# Altium schematic sheet 01_Power.SchDoc: Power
size A4; SheetNumber: 1; SheetTotal: 3; PageSetup: Record=PageOptions|CenterHorizontal=True|CenterVertical=True|PrintScale=1.09|XCorrection=1.00|YCorrection=1.00|PrintKind=0|BorderSize=5000000|LeftOffset=0|BottomOffset=0|Orientation=2|PaperLength=1000|PaperWidth=1000|Scale=100|PaperSource=7|PrintQuality=-3|MediaType=1|DitherType=10|PrintScaleMode=1|PaperKind=A4|PaperIndex=9; SK_ProjectName: ESP8266 IoT Dimmer; Version: R01
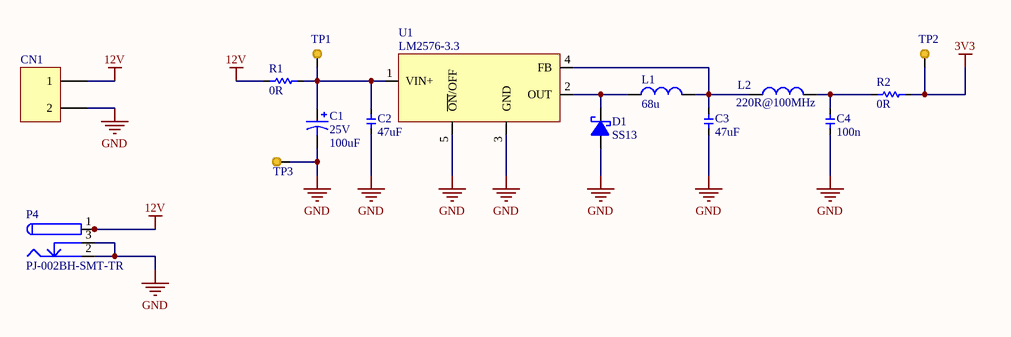
[diagram p0: 01_Power.SchDoc]

## Parts
C1  25V  value 100uF  [Electrolytic Cap 2.54mm]
C2  value 47uF  [CAPC_1411_3528_X08N]  (hidden comment: Cap)
C3  value 47uF  [CAPC_1411_3528_X08N]  (hidden comment: Cap)
C4  value 100n  [0603 - CAP]  (hidden comment: Cap)
CN1  Terminal 2 - 5mm  [Terminal 2]  (value not drawn)
D1  SS13  [SOD123F]
L1  value 68u  [IND_TH_SMD]  (hidden comment: Inductor)
L2  value 220R@100MHz  [0603]  (hidden comment: Inductor)
P4  PJ-002BH-SMT-TR  [PJ-002BH-SMT-TR]
R1  value 0R  [0603]  (hidden comment: Res)
R2  value 0R  [0603]  (hidden comment: Res)
TP1  Test Point 0.6mm  [TP_SMD_1mm]  (value not drawn)  (no BOM)
TP2  Test Point 0.6mm  [TP_SMD_1mm]  (value not drawn)  (no BOM)
TP3  Test Point 0.6mm  [TP_SMD_1mm]  (value not drawn)  (no BOM)
U1  LM2576-3.3  [TO263-5]

## Nets
3V3: R2.1 TP2.1
12V: CN1.1 P4.1 P4.1A R1.2
GND: C1.2 C2.1 C3.1 C4.1 CN1.2 D1.A P4.2 P4.3 TP3.1 U1.3(GND) U1.5(~{ON}/OFF)
NetC1_1: C1.1 C2.2 R1.1 TP1.1 U1.1(VIN+)
NetC3_2: C3.2 L1.2 L2.1 U1.4(FB)
NetC4_2: C4.2 L2.2 R2.2
NetD1_K: D1.K L1.1 U1.2(OUT)

## Notes on the sheet
- Title:
- Project:
- Version:
- sasakaranovic.com
- Sasa Karanovic
- Project available at
- Date:
- Time:
- Sheet
- of

## Library data of the parts
C1 = Cap Electrolytic: CAP ALUM 100UF 20% 25V RADIAL; Manufacturer: Nichicon; Manufacturer Part Number: UHE1E101MED; Distributor: DigiKey; Distributor Part Number: 493-1548-ND
C2 C3 = Cap: CAP TANT POLY47UF 20% 16V 1210; Manufacturer: AVX Corporation; Manufacturer Part Number: TCNT476M016R0200A; Distributor Part Number: 478-9595-1-ND; Distributor: DigiKey
C4 = Cap: Capacitor; Manufacturer: AVX Corporation; Manufacturer Part Number: 06035C104KAT2A; Distributor Part Number: 478-5052-1-ND; Distributor: DigiKey
CN1 = Terminal 2: TERM BLOCK PCB 2POS 5.0MM GREEN; Manufacturer: Phoenix Contact; Manufacturer Part Number: 1935161; Distributor: DigiKey; Distributor Part Number: 277-1667-ND
D1 = Diode Schotky: DIODE SCHOTTKY 30V 1A SMA; Manufacturer: ON Semiconductor; Manufacturer Part Number: SS13; Distributor: DigiKey; Distributor Part Number: SS13FSCT-ND
L1 = Inductor: FIXED IND 68UH 1A 289 MOHM SMD; Manufacturer: Laird-Signal Integrity Products; Manufacturer Part Number: TYS6045680M-10; Distributor: DigiKey; Distributor Part Number: 240-2747-1-ND
L2 = Inductor: FERRITE BEAD 220 OHM 0603 1LN; Manufacturer: Murata Electronics North America; Manufacturer Part Number: BLM18KG221SN1D; Distributor: DigiKey; Distributor Part Number: 490-5255-1-ND
P4 = DC Jack 2.5mm - Male: CONN PWR JACK 2.5X5.5MM SOLDER; Manufacturer: CUI Inc.; Manufacturer Part Number: PJ-002BH-SMT-TR; Distributor: DigiKey; Distributor Part Number: CP-002BHPJCT-ND
R1 R2 = Res: Resistor; Manufacturer: Yageo; Manufacturer Part Number: RC0603JR-070RL; Distributor: DigiKey; Distributor Part Number: 311-0.0GRCT-ND
TP1-TP3 = TP
U1 = LM2576-xx: Switching mode regulator [ 3v3, 5v, 12v and ADJ ]; Manufacturer: Microchip Technology; Manufacturer Part Number: LM2576-3.3WU; Distributor: DigiKey; Distributor Part Number: LM2576-3.3WU-ND